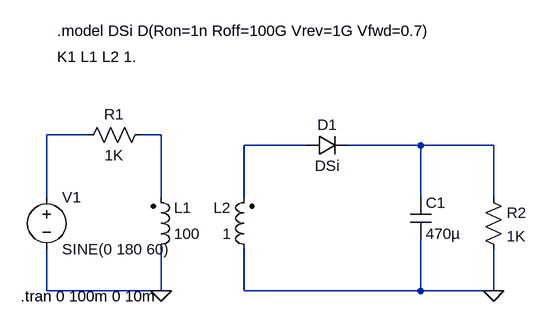
[diagram p0: schematic LucasSantos_Ana_RetificadorMO.asc]
LucasSantos_Ana_RetificadorMO.asc, the LTspice schematic file:
Version 4
SHEET 1 880 680
WIRE 128 48 64 48
WIRE 240 48 208 48
WIRE 464 64 368 64
WIRE 640 64 528 64
WIRE 752 64 640 64
WIRE 64 144 64 48
WIRE 240 144 240 48
WIRE 368 144 368 64
WIRE 640 144 640 64
WIRE 752 144 752 64
WIRE 64 288 64 224
WIRE 240 288 240 224
WIRE 240 288 64 288
WIRE 368 288 368 224
WIRE 640 288 640 208
WIRE 640 288 368 288
WIRE 752 288 752 224
WIRE 752 288 640 288
FLAG 752 288 0
FLAG 240 288 0
SYMBOL voltage 64 128 R0
WINDOW 123 0 0 Left 0
WINDOW 39 0 0 Left 0
SYMATTR InstName V1
SYMATTR Value SINE(0 180 60)
SYMBOL ind2 224 240 M180
WINDOW 0 36 80 Left 2
WINDOW 3 36 40 Left 2
SYMATTR InstName L1
SYMATTR Value 100
SYMBOL ind2 384 240 R180
WINDOW 0 36 80 Left 2
WINDOW 3 36 40 Left 2
SYMATTR InstName L2
SYMATTR Value 1
SYMBOL res 224 32 R90
WINDOW 0 0 56 VBottom 2
WINDOW 3 32 56 VTop 2
SYMATTR InstName R1
SYMATTR Value 1K
SYMBOL res 736 128 R0
SYMATTR InstName R2
SYMATTR Value 1K
SYMBOL diode 464 80 R270
WINDOW 0 32 32 VTop 2
WINDOW 3 0 32 VBottom 2
SYMATTR InstName D1
SYMATTR Value DSi
SYMBOL cap 624 144 R0
SYMATTR InstName C1
SYMATTR Value 470µ
TEXT 80 -72 Left 2 !K1 L1 L2 1.
TEXT 80 -112 Left 2 !.model DSi D(Ron=1n Roff=100G Vrev=1G Vfwd=0.7)
TEXT 24 296 Left 2 !.tran 0 100m 0 10m

The netlist it stands for:
* LucasSantos_Ana_RetificadorMO.asc
V1 N001 0 SINE(0 180 60)
L1 0 N002 100
L2 0 N003 1
R1 N002 N001 1K
R2 N004 0 1K
D1 N003 N004 DSi
C1 N004 0 470µ
.model D D
.lib standard.dio
K1 L1 L2 1.
.model DSi D(Ron=1n Roff=100G Vrev=1G Vfwd=0.7)
.tran 0 100m 0 10m
.backanno
.end